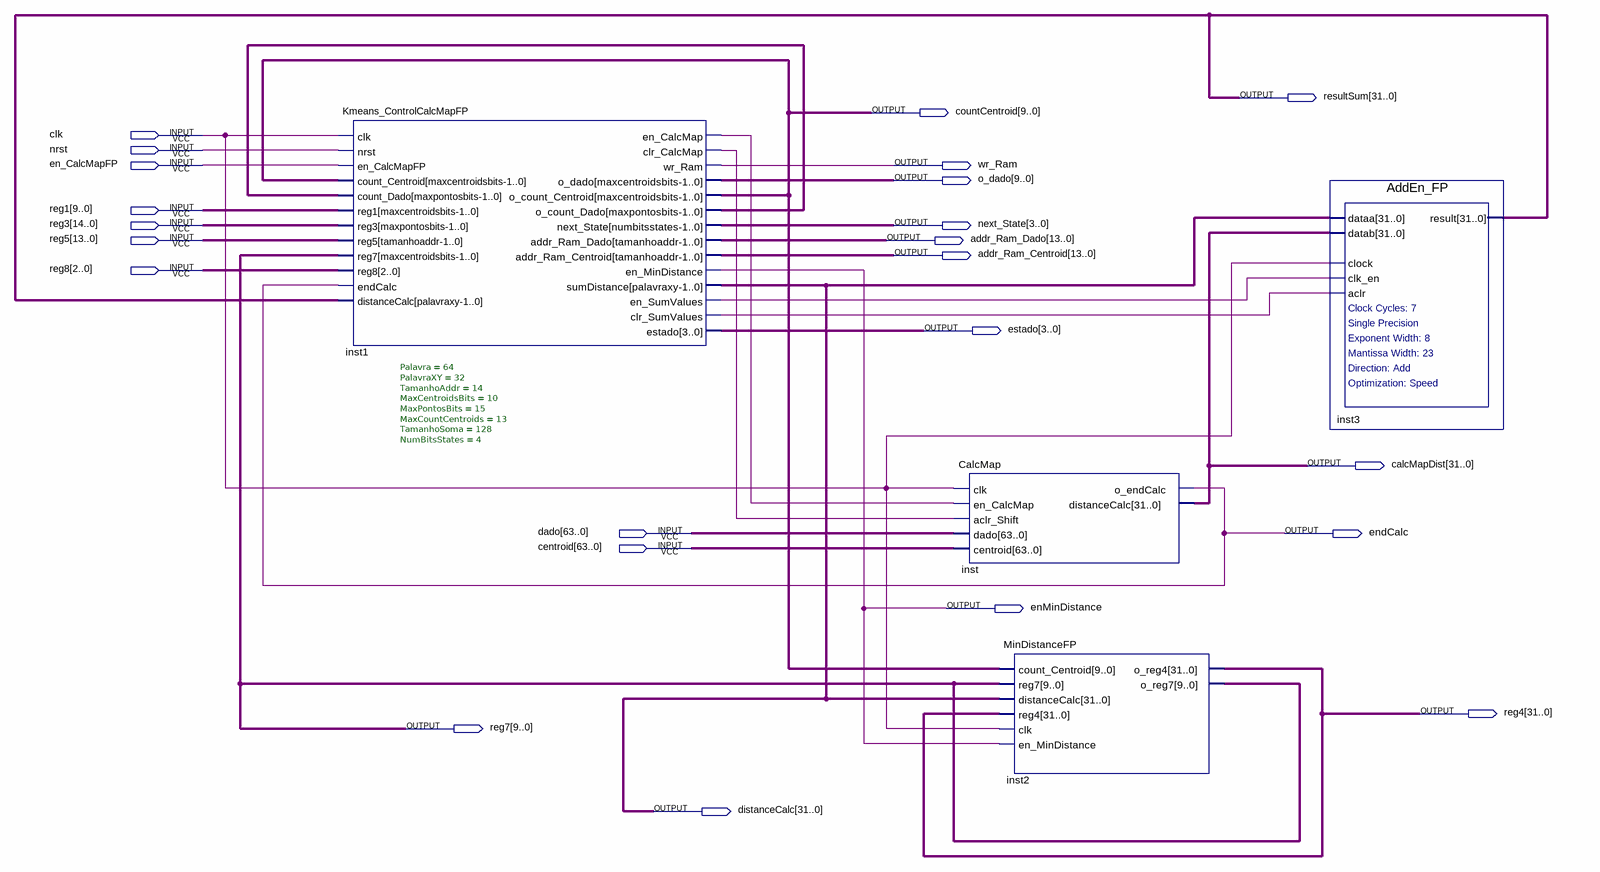
[diagram p0: schematic sheet]
// Quartus schematic Kmeans_CalcMapModuleFP.bdf as structural Verilog: 4 symbols, 23 pins
module Kmeans_CalcMapModuleFP (
  input  clk,
  input  nrst,
  input  en_CalcMapFP,
  input  [9:0] reg1,
  input  [14:0] reg3,
  input  [13:0] reg5,
  input  [2:0] reg8,
  input  [63:0] dado,
  input  [63:0] centroid,
  output [31:0] resultSum,
  output [9:0] countCentroid,
  output wr_Ram,
  output [9:0] o_dado,
  output [3:0] next_State,
  output [13:0] addr_Ram_Dado,
  output [13:0] addr_Ram_Centroid,
  output [3:0] estado,
  output [31:0] calcMapDist,
  output endCalc,
  output enMinDistance,
  output [31:0] reg4,
  output [9:0] reg7,
  output [31:0] distanceCalc
);

  wire inst1_clr_calcmap, inst1_clr_sumvalues, inst1_en_calcmap, inst1_en_sumvalues;
  wire [14:0] inst1_o_count_dado;

  Kmeans_ControlCalcMapFP #(.Palavra(64), .PalavraXY(32), .TamanhoAddr(14), .MaxCentroidsBits(10), .MaxPontosBits(15), .MaxCountCentroids(13), .TamanhoSoma(128), .NumBitsStates(4)) inst1 (
    .clk(clk), .nrst(nrst), .en_CalcMapFP(en_CalcMapFP), .count_Centroid(countCentroid),
    .count_Dado(inst1_o_count_dado), .reg1(reg1), .reg3(reg3), .reg5(reg5), .reg7(reg7), .reg8(reg8),
    .endCalc(endCalc), .distanceCalc(resultSum), .en_CalcMap(inst1_en_calcmap),
    .clr_CalcMap(inst1_clr_calcmap), .wr_Ram(wr_Ram), .o_dado(o_dado), .o_count_Centroid(countCentroid),
    .o_count_Dado(inst1_o_count_dado), .next_State(next_State), .addr_Ram_Dado(addr_Ram_Dado),
    .addr_Ram_Centroid(addr_Ram_Centroid), .en_MinDistance(enMinDistance), .sumDistance(distanceCalc),
    .en_SumValues(inst1_en_sumvalues), .clr_SumValues(inst1_clr_sumvalues), .estado(estado));
  CalcMap inst (
    .clk(clk), .en_CalcMap(inst1_en_calcmap), .aclr_Shift(inst1_clr_calcmap), .dado(dado),
    .centroid(centroid), .o_endCalc(endCalc), .distanceCalc(calcMapDist));
  MinDistanceFP inst2 (
    .count_Centroid(countCentroid), .reg7(reg7), .distanceCalc(distanceCalc), .reg4(reg4), .clk(clk),
    .en_MinDistance(enMinDistance), .o_reg4(reg4), .o_reg7(reg7));
  AddEn_FP inst3 (
    .dataa(distanceCalc), .datab(calcMapDist), .clock(clk), .clk_en(inst1_en_sumvalues),
    .aclr(inst1_clr_sumvalues), .result(resultSum));
endmodule
